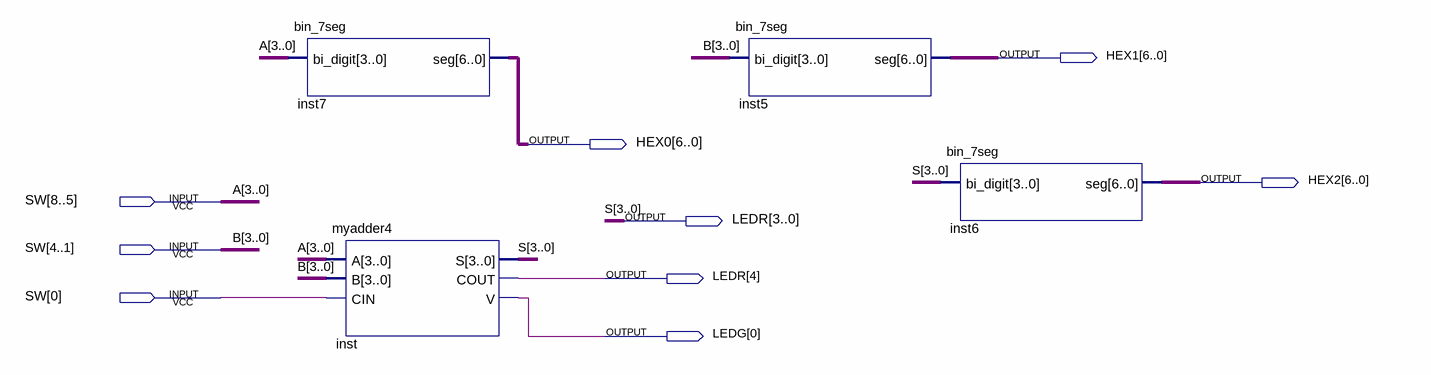
[diagram p0: schematic sheet]
// Quartus schematic Lab5.bdf as structural Verilog: 4 symbols, 9 pins
module Lab5 (
  input  [8:0] SW,
  output [6:0] HEX1,
  output [6:0] HEX0,
  output [6:0] HEX2,
  output [4:0] LEDR,
  output [0:0] LEDG
);

  bin_7seg inst7 (.bi_digit(SW[8:5]), .seg(HEX0));
  myadder4 inst (.A(SW[8:5]), .B(SW[4:1]), .CIN(SW[0]), .S(LEDR[3:0]), .COUT(LEDR[4]), .V(LEDG[0]));
  bin_7seg inst5 (.bi_digit(SW[4:1]), .seg(HEX1));
  bin_7seg inst6 (.bi_digit(LEDR[3:0]), .seg(HEX2));

  // Other names for the same wires on the sheet: A[3:0] = SW[8:5]; B[3:0] = SW[4:1]; S[3:0] = LEDR[3:0]
endmodule
